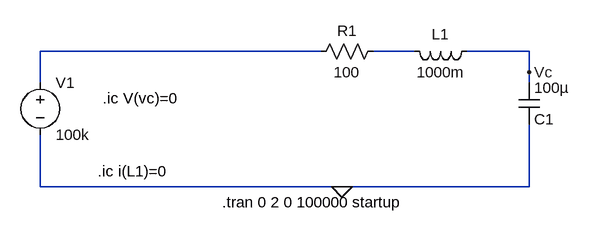
[diagram p0: schematic RLC CIRCUIT WITH DIODE_dc input series.asc]
RLC CIRCUIT WITH DIODE_dc input series.asc, the LTspice schematic file:
Version 4
SHEET 1 880 680
WIRE 160 112 -272 112
WIRE 304 112 240 112
WIRE 480 112 384 112
WIRE 480 144 480 112
WIRE -272 160 -272 112
WIRE 480 160 480 144
WIRE -272 320 -272 240
WIRE 192 320 -272 320
WIRE 480 320 480 224
WIRE 480 320 192 320
FLAG 192 320 0
FLAG 480 144 Vc
SYMBOL ind 400 96 R90
WINDOW 0 5 56 VBottom 2
WINDOW 3 32 56 VTop 2
SYMATTR InstName L1
SYMATTR Value 1000m
SYMATTR SpiceLine Rser=1
SYMBOL cap 464 160 R0
WINDOW 0 24 56 Left 2
WINDOW 3 24 8 Left 2
SYMATTR InstName C1
SYMATTR Value 100µ
SYMATTR SpiceLine V=3k
SYMBOL voltage -272 144 R0
WINDOW 123 0 0 Left 0
WINDOW 39 0 0 Left 0
SYMATTR InstName V1
SYMATTR Value 100k
SYMBOL res 256 96 R90
WINDOW 0 0 56 VBottom 2
WINDOW 3 32 56 VTop 2
SYMATTR InstName R1
SYMATTR Value 100
TEXT 8 344 Left 2 !.tran 0 2 0 100000 startup
TEXT -184 296 Left 2 !.ic i(L1)=0
TEXT -176 184 Left 2 !.ic V(vc)=0

The netlist it stands for:
* RLC CIRCUIT WITH DIODE_dc input series.asc
L1 Vc N002 1000m Rser=1
C1 Vc 0 100µ V=3k
V1 N001 0 100k
R1 N002 N001 100
.tran 0 2 0 100000 startup
.ic i(L1)=0
.ic V(vc)=0
.backanno
.end